# EAGLE design version0 (EAGLE 7.6.0)
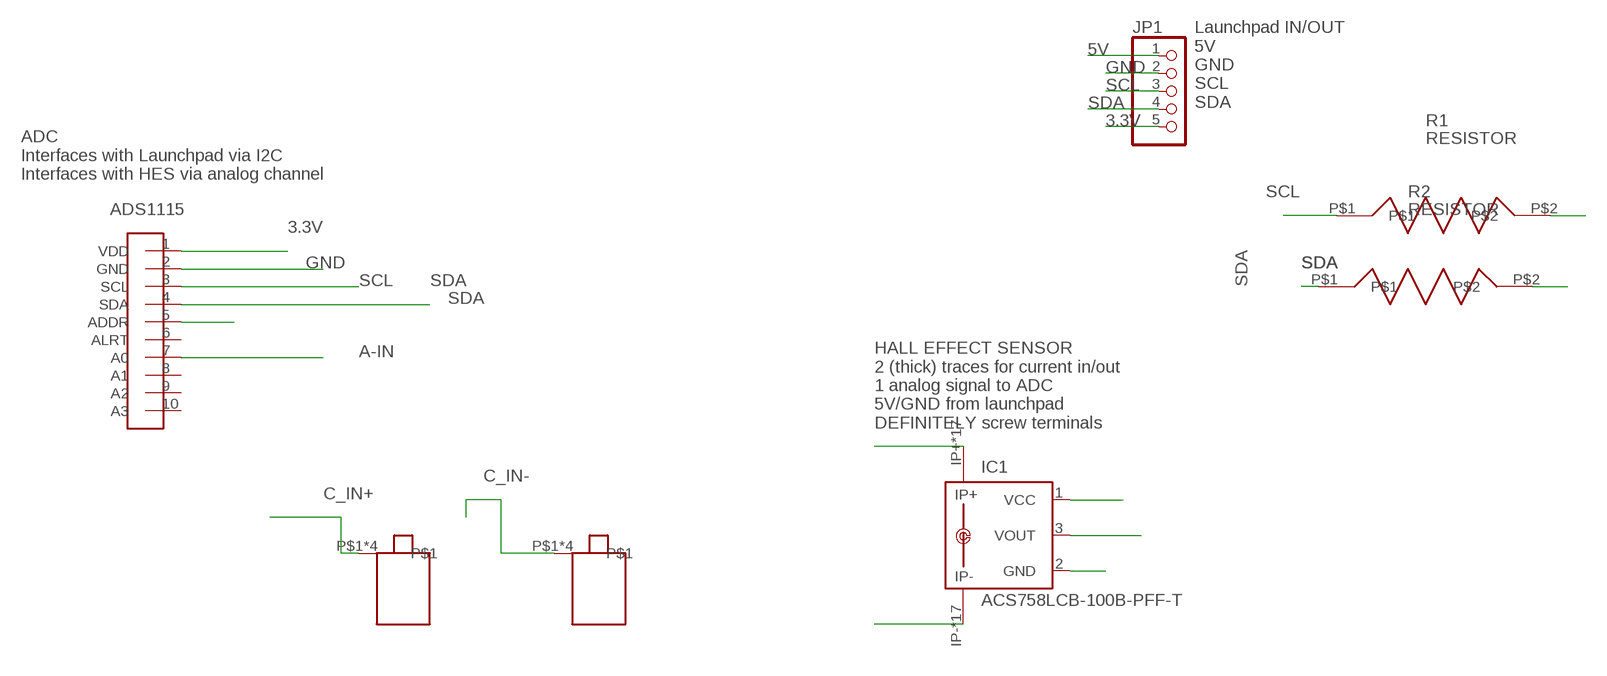
[diagram p0: schematic, sheet 1]

## Parts
ADC_JUMPER  ADS1115-BREAKOUTBOARD  [1X10]
IC1  ACS758LCB-100B-PFF-T  [CB-PFF]
JP1  PINHD-1X5  [1X05]
R1  RESISTOR  [0805]
R2  RESISTOR  [0805]
U$1  SCREW_TERM_50A  [SCREW_TERM_50A]  (not placed on a sheet)
U$2  SCREW_TERM_50A  [SCREW_TERM_50A]  (not placed on a sheet)
U$3  SCREW_TERM_50A  [SCREW_TERM_50A]  (not placed on a sheet)
U$4  SCREW_TERM_50A  [SCREW_TERM_50A]  (not placed on a sheet)
U$5  SCREW_TERM_50A  [SCREW_TERM_50A]
U$6  SCREW_TERM_50A  [SCREW_TERM_50A]

## Nets
3.3V: ADC_JUMPER.1(VDD) JP1.5 R1.P$2 R2.P$2
5V: IC1.1(VCC) JP1.1
A-IN: ADC_JUMPER.7(A0) IC1.3(VOUT)
C_IN+: IC1.IP+ IC1.IP+@2(IP+) IC1.IP+@3(IP+) IC1.IP+@4(IP+) IC1.IP+@5(IP+) IC1.IP+@6(IP+) IC1.IP+@7(IP+) IC1.IP+@8(IP+) IC1.IP+@9(IP+) IC1.IP+@10(IP+) IC1.IP+@11(IP+) IC1.IP+@12(IP+) IC1.IP+@13(IP+) IC1.IP+@14(IP+) IC1.IP+@15(IP+) IC1.IP+@16(IP+) IC1.IP+@17(IP+) U$5.P$1 U$5.P$2 U$5.P$3 U$5.P$4
C_IN-: IC1.IP- IC1.IP-@2(IP-) IC1.IP-@3(IP-) IC1.IP-@4(IP-) IC1.IP-@5(IP-) IC1.IP-@6(IP-) IC1.IP-@7(IP-) IC1.IP-@8(IP-) IC1.IP-@9(IP-) IC1.IP-@10(IP-) IC1.IP-@11(IP-) IC1.IP-@12(IP-) IC1.IP-@13(IP-) IC1.IP-@14(IP-) IC1.IP-@15(IP-) IC1.IP-@16(IP-) IC1.IP-@17(IP-) U$6.P$1 U$6.P$2 U$6.P$3 U$6.P$4
GND: ADC_JUMPER.2(GND) ADC_JUMPER.5(ADDR) IC1.2(GND) JP1.2
SCL: ADC_JUMPER.3(SCL) JP1.3 R1.P$1
SDA: ADC_JUMPER.4(SDA) JP1.4 R2.P$1
Unconnected: ADC_JUMPER.6(ALRT) ADC_JUMPER.8(A1) ADC_JUMPER.9(A2) ADC_JUMPER.10(A3) U$1.P$1 U$1.P$2 U$1.P$3 U$1.P$4 U$2.P$1 U$2.P$2 U$2.P$3 U$2.P$4 U$3.P$1 U$3.P$2 U$3.P$3 U$3.P$4 U$4.P$1 U$4.P$2 U$4.P$3 U$4.P$4

## Notes on the sheet
- Launchpad IN/OUT
  5V 
  GND
  SCL
  SDA
- ADC
  Interfaces with Launchpad via I2C
  Interfaces with HES via analog channel
- HALL EFFECT SENSOR
  2 (thick) traces for current in/out
  1 analog signal to ADC
  5V/GND from launchpad
  DEFINITELY screw terminals

## Library data of the parts
ADC_JUMPER = currentMonitoring:ADS1115-BREAKOUTBOARD
IC1 = allegro:ACS758*: Thermally Enhanced, Fully Integrated, Hall Effect-Based Linear Current Sensor with 100 micro Ohm Current Conductor display layer 49 Reference in BRD and place VIAs on circles Source: http://www.allegromicro.com/en/Products/Part_Numbers/0758/0758.pdf; MPN: ACS758LCB-100B-PFF-T; OC_FARNELL: 1718998; OC_NEWARK: 04R7132
JP1 = pinhead:PINHD-1X5: PIN HEADER
R1 R2 = AAASam:RESISTOR
U$1-U$6 = currentMonitoring:SCREW_TERM_50A

## Board
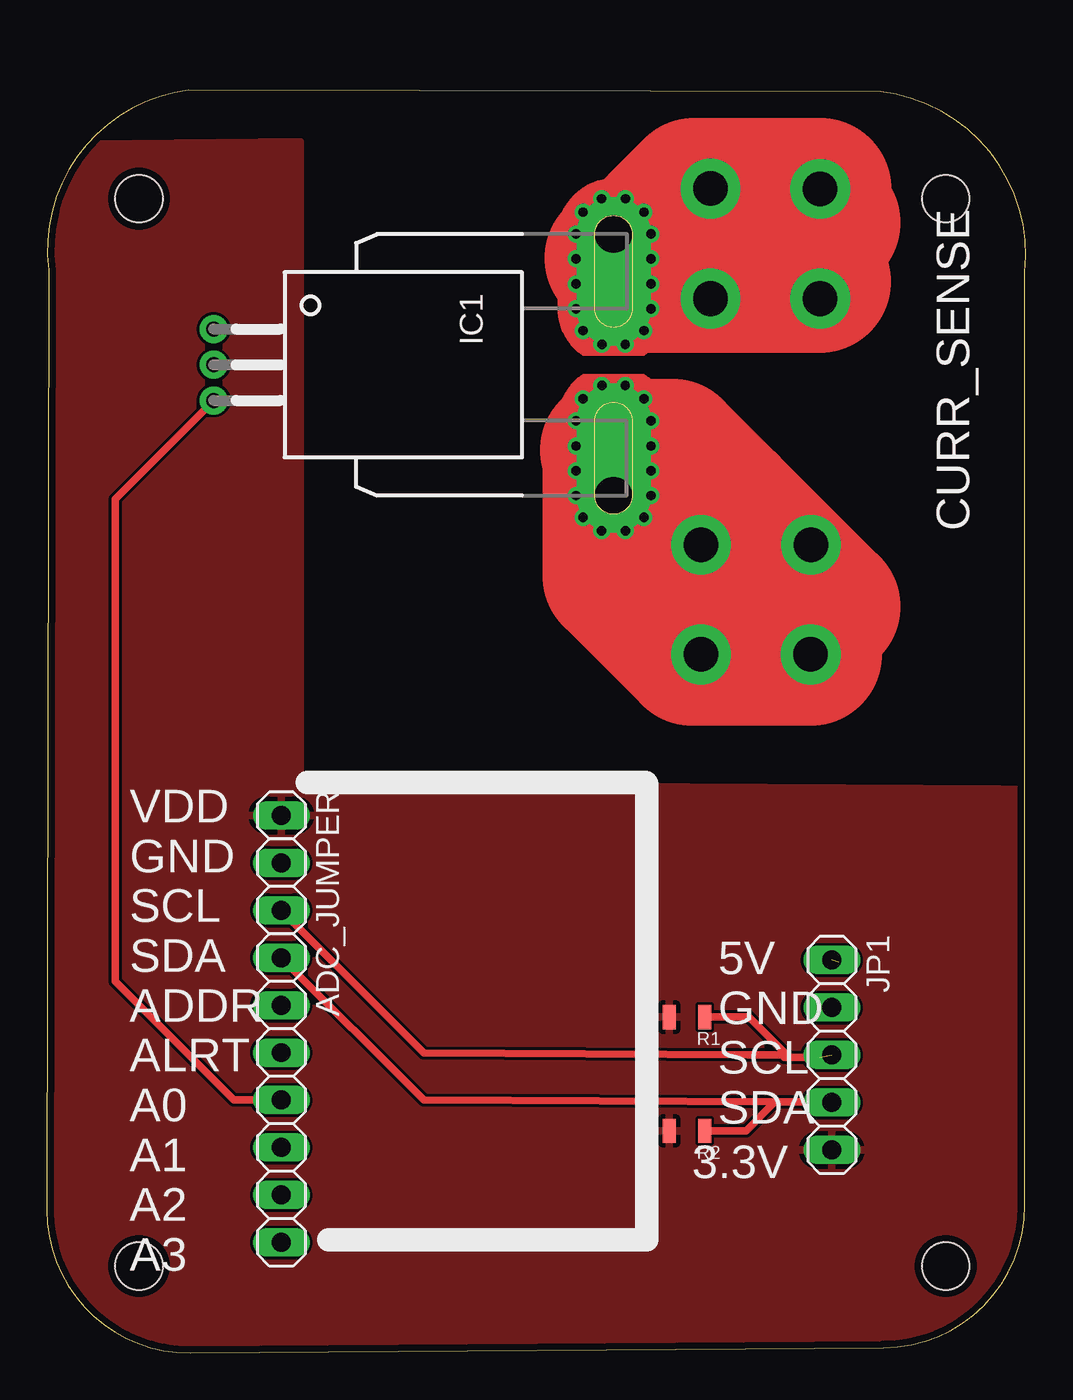
[diagram p1: board, top side]
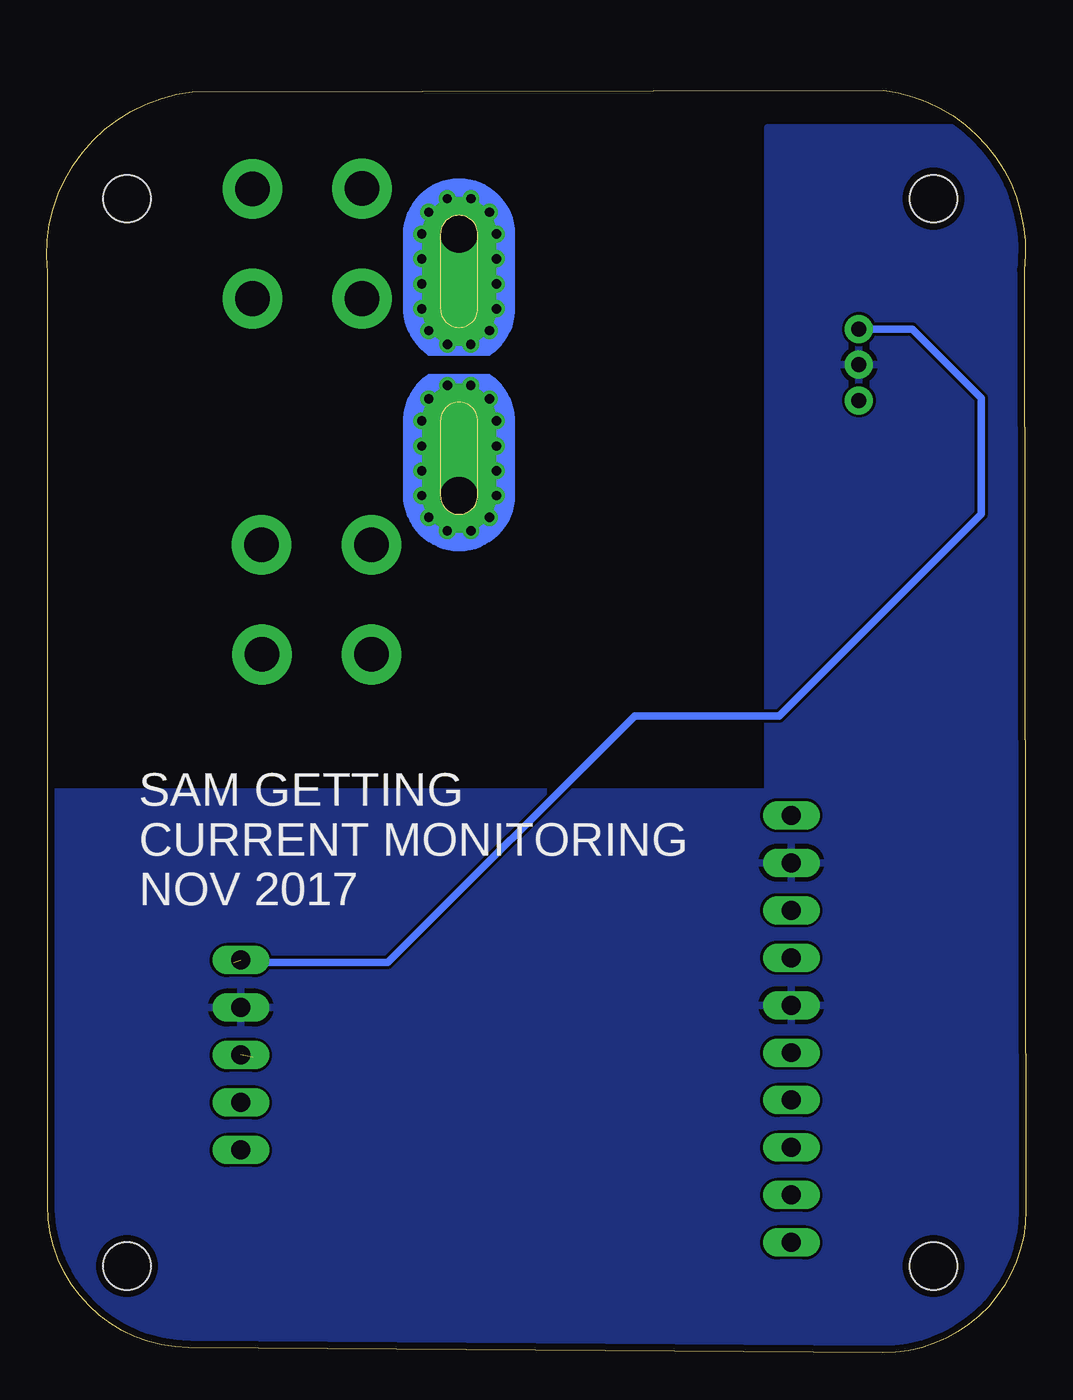
[diagram p2: board, bottom side, seen from below]

Size 52.41 x 67.61 mm. Coordinates in mm from the lower left corner, seen from the top.
Outline: 0.1,57.97 0,7.64 arc91 7.68,0 44.8,0.27 arc90 52.36,7.89 52.36,57.87 arc90 44.63,67.52 7.61,67.61 arc90 0.1,57.97
Copper layers (1*16): Top 0.0356mm / dielectric 1.5011mm / Bottom 0.0356mm
Design rules "OSHPARK": minimum track width 6mil, minimum drill 13mil, track to track 6mil, track to pad 6mil, pad to pad 6mil, via to via 6mil, smd to smd 6mil, copper to edge 15mil, drill to drill 6mil, minimum pad ring 7mil, minimum via ring 7mil, stop-mask expansion 3mil, vias tented up to drill 0mil, thermal gap 10mil
Holes 2.54 mm at 48.12,4.64 48.12,61.79 4.94,61.79 4.94,4.64

### Footprints (pad centres in the part's own frame; a part is rotated, then mirrored left to right if it is on the bottom)
1X10 = drill 1.016 long: 1 -11.43,0; 2 -8.89,0; 3 -6.35,0; 4 -3.81,0; 5 -1.27,0; 6 1.27,0; 7 3.81,0; 8 6.35,0; 9 8.89,0; 10 11.43,0
CB-PFF = drill 0.8 pad 1.5: 1 -1.91,-21.4; 2 0,-21.4; 3 1.91,-21.4 | drill 2 pad 4 offset: IP+ 7,0; IP- -7,0 | drill 0.5 pad 0.9: IP+@2 8.89,0.635; IP+@3 8.89,-0.635; IP+@4 8.175,-1.625; IP+@5 7,-2; IP+@6 5.675,-2; IP+@7 4.35,-2; IP+@8 3,-2; IP+@9 1.825,-1.625; IP+@10 1.1,-0.625; IP+@11 1.1,0.625; IP+@12 1.825,1.625; IP+@13 3,2; IP+@14 4.35,2; IP+@15 5.675,2; IP+@16 7,2; IP+@17 8.175,1.625; IP-@2 -8.89,0.635; IP-@3 -8.89,-0.635; IP-@4 -8.175,-1.625; IP-@5 -7,-2; IP-@6 -5.675,-2; IP-@7 -4.325,-2; IP-@8 -3,-2; IP-@9 -1.825,-1.625; IP-@10 -1.1,-0.625; IP-@11 -1.1,0.625; IP-@12 -1.825,1.625; IP-@13 -3,2; IP-@14 -4.325,2; IP-@15 -5.675,2; IP-@16 -7,2; IP-@17 -8.175,1.625
1X05 = drill 1.016 long: 1 -5.08,0; 2 -2.54,0; 3 0,0; 4 2.54,0; 5 5.08,0
0805 = smd 0.7 x 1.3: P$1 -0.95,0; P$2 0.95,0
SCREW_TERM_50A = drill 1.85 pad 3.2: P$1 -2.935,2.935; P$2 2.955,2.935; P$3 -2.935,-2.935; P$4 2.935,-2.935

### Placement (x,y rotation side)
ADC_JUMPER  12.56,17.34 270 top
IC1  30.34,52.9 270 top
JP1  42.02,15.95 270 top
R1  34.28,17.98 180 top
R2  34.28,11.88 180 top
U$5  37.96,40.33 0 top
U$6  38.47,59.38 90 top

### Tracks (layer width: path | path; a pad name or v marks a point on that pad's centre or on a via)
3.3V
  pour Top: -17.92,-5.52 76.06,-5.52 76.06,30.04 13.57,30.42 13.57,64.84 -17.92,64.46
5V  (1 unrouted)
  Bottom 0.406: IC1.1 6.09,54.81 2.4,51.13 2.4,44.9 13.19,34.11 20.94,34.11 34.15,20.9 42.4,20.9 42.53,20.77
A-IN
  Top 0.406: IC1.3 3.67,45.72 3.67,19.88 10.02,13.53 ADC_JUMPER.7
C_IN+
  Top 0.406: U$5.P$4 40.89,43.25 U$5.P$2 40.91,40.93 41.9,39.95 37.58,39.95 U$5.P$3 | U$5.P$1 35.02,44 36.43,45.41 | 33.51,48.33 31.48,48.33 30.97,48.84 33.26,48.84 34.15,47.95 34.15,46.17 32.62,44.65 32.62,42.11 33.13,41.6 33.13,43.11 IC1.IP+
  Top 7.62: U$5.P$4 U$5.P$3 34.54,37.4 30.34,41.6 IC1.IP+ 30.34,48.2 30.21,48.33 33.51,48.33 36.43,45.41 41.9,39.95
C_IN-
  Top 0.406: U$6.P$1 35.53,57.08 37.64,59.19 | U$6.P$2 32.4,62.34 32.24,62.17 32.24,61.36 IC1.IP-@17 | 32.22,57.35 33.26,57.35 33.89,56.71 42.66,56.71 43.04,57.09 43.04,60.27 41.9,61.41 41.9,61.79 41.51,62.17 41.39,62.17 38.85,59.63 38.85,57.6 41.64,54.81 41.64,56.84 42.4,57.6 39.23,57.6 38.47,58.36 40.12,58.36 40.75,59 41.01,59 41.9,58.11 41.9,57.86 41.51,57.48 41.51,56.56 U$6.P$3 | 31.74,57.35 32.22,57.35 | 32.22,57.35 IC1.IP-@14
  Top 7.62: U$6.P$4 34.67,62.32 30.85,58.49 36.94,58.49 37.64,59.19 40.75,62.3 40.75,59 40.75,57.98 41.39,57.35 31.74,57.35 30.47,58.62 39.99,58.62 41.9,60.52
GND
  pour Bottom: -19.19,65.6 13.83,65.6 13.83,30.04 76.06,30.04 76.06,-6.79 -18.94,-6.28
SCL  (1 unrouted)
  Top 0.406: ADC_JUMPER.3 20.18,16.07 37.52,15.95 39.36,15.95 | 39.36,15.95 39.61,15.95 37.58,17.98 R1.P$1 | 41.39,15.82 39.48,15.82 39.36,15.95
SDA
  Top 0.406: ADC_JUMPER.4 20.18,13.53 38.98,13.43 | R2.P$1 37.43,11.88 38.98,13.43 | 38.98,13.43 42,13.43 JP1.4

### Text on the board
tPlace: 5V / GND / SCL / SDA | VDD / GND / SCL / SDA / ADDR / ALRT / A0 / A1 / A2 / A3
tNames: CURR_SENSE | 3.3V
bNames: SAM GETTING / CURRENT MONITORING / NOV 2017